# EasyEDA Pro project PCB.epro, board PCB1_4
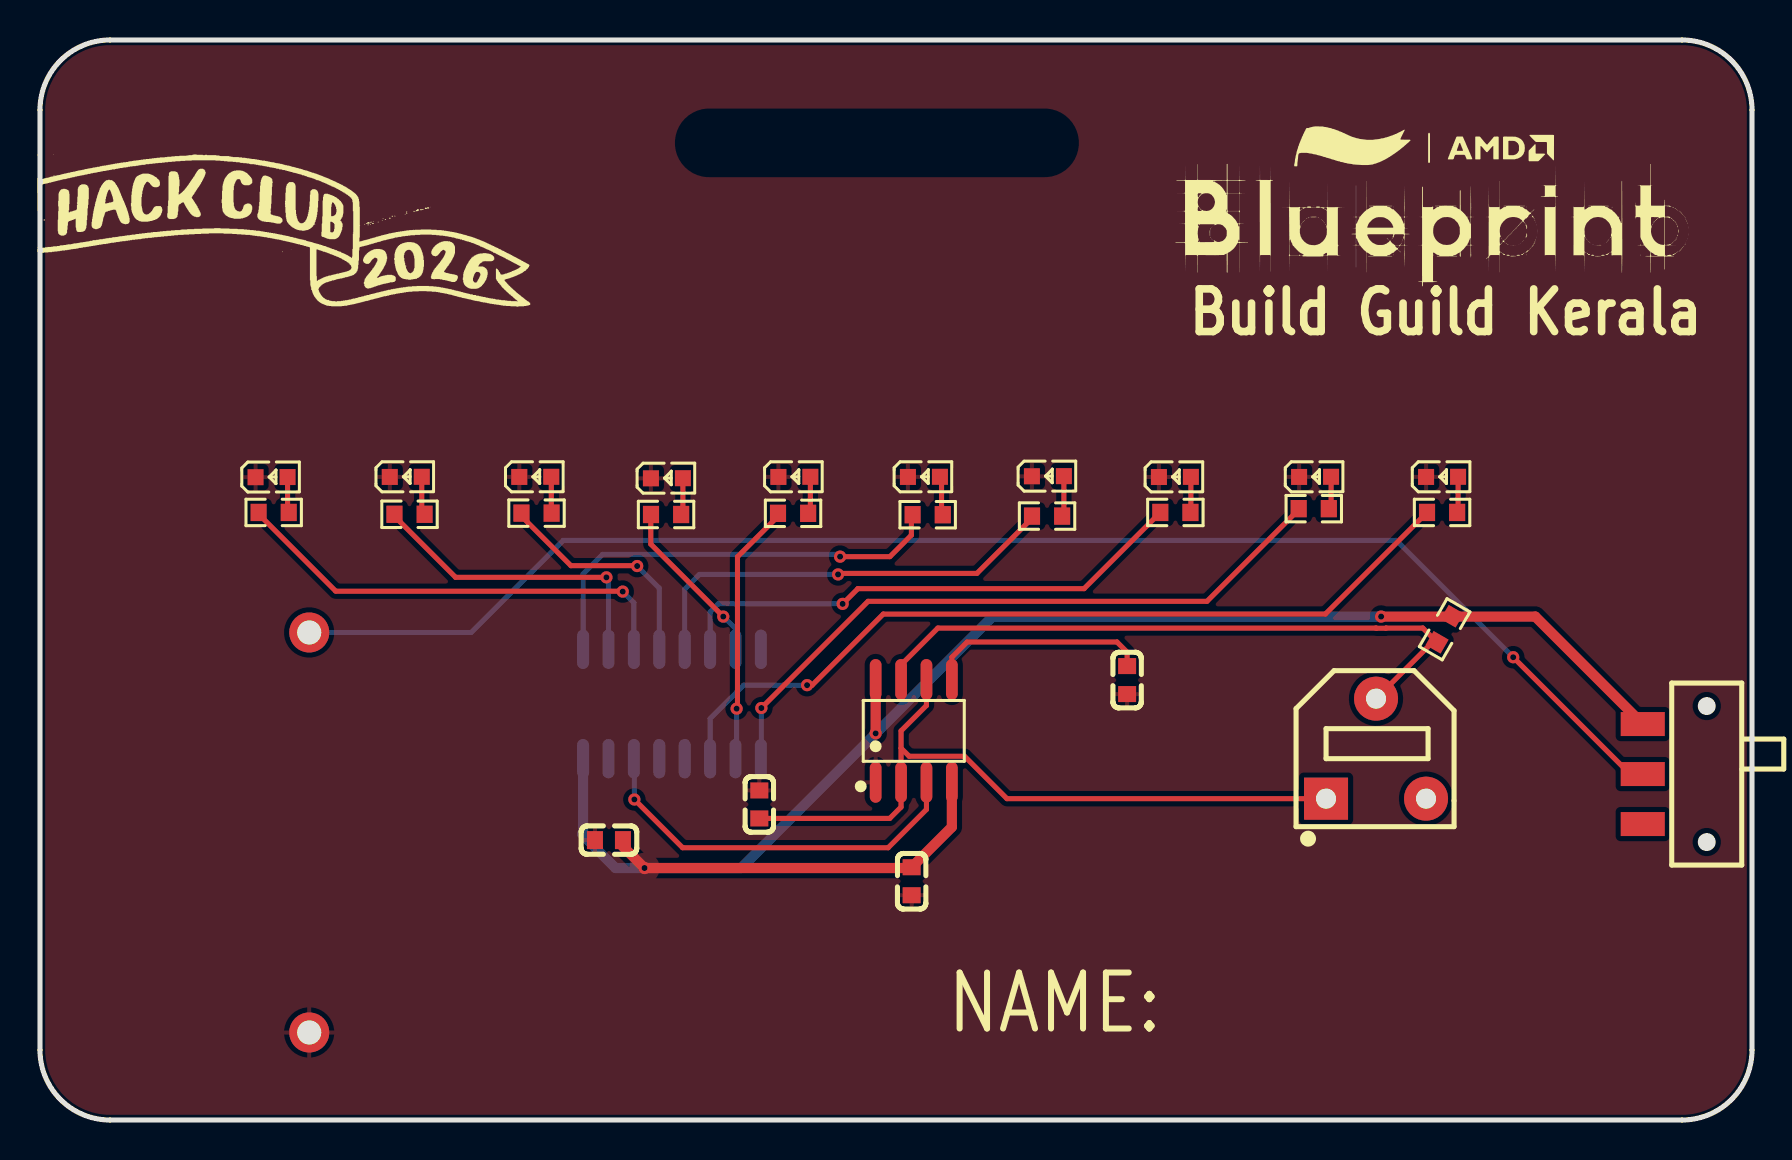
[diagram p13: board, top side]
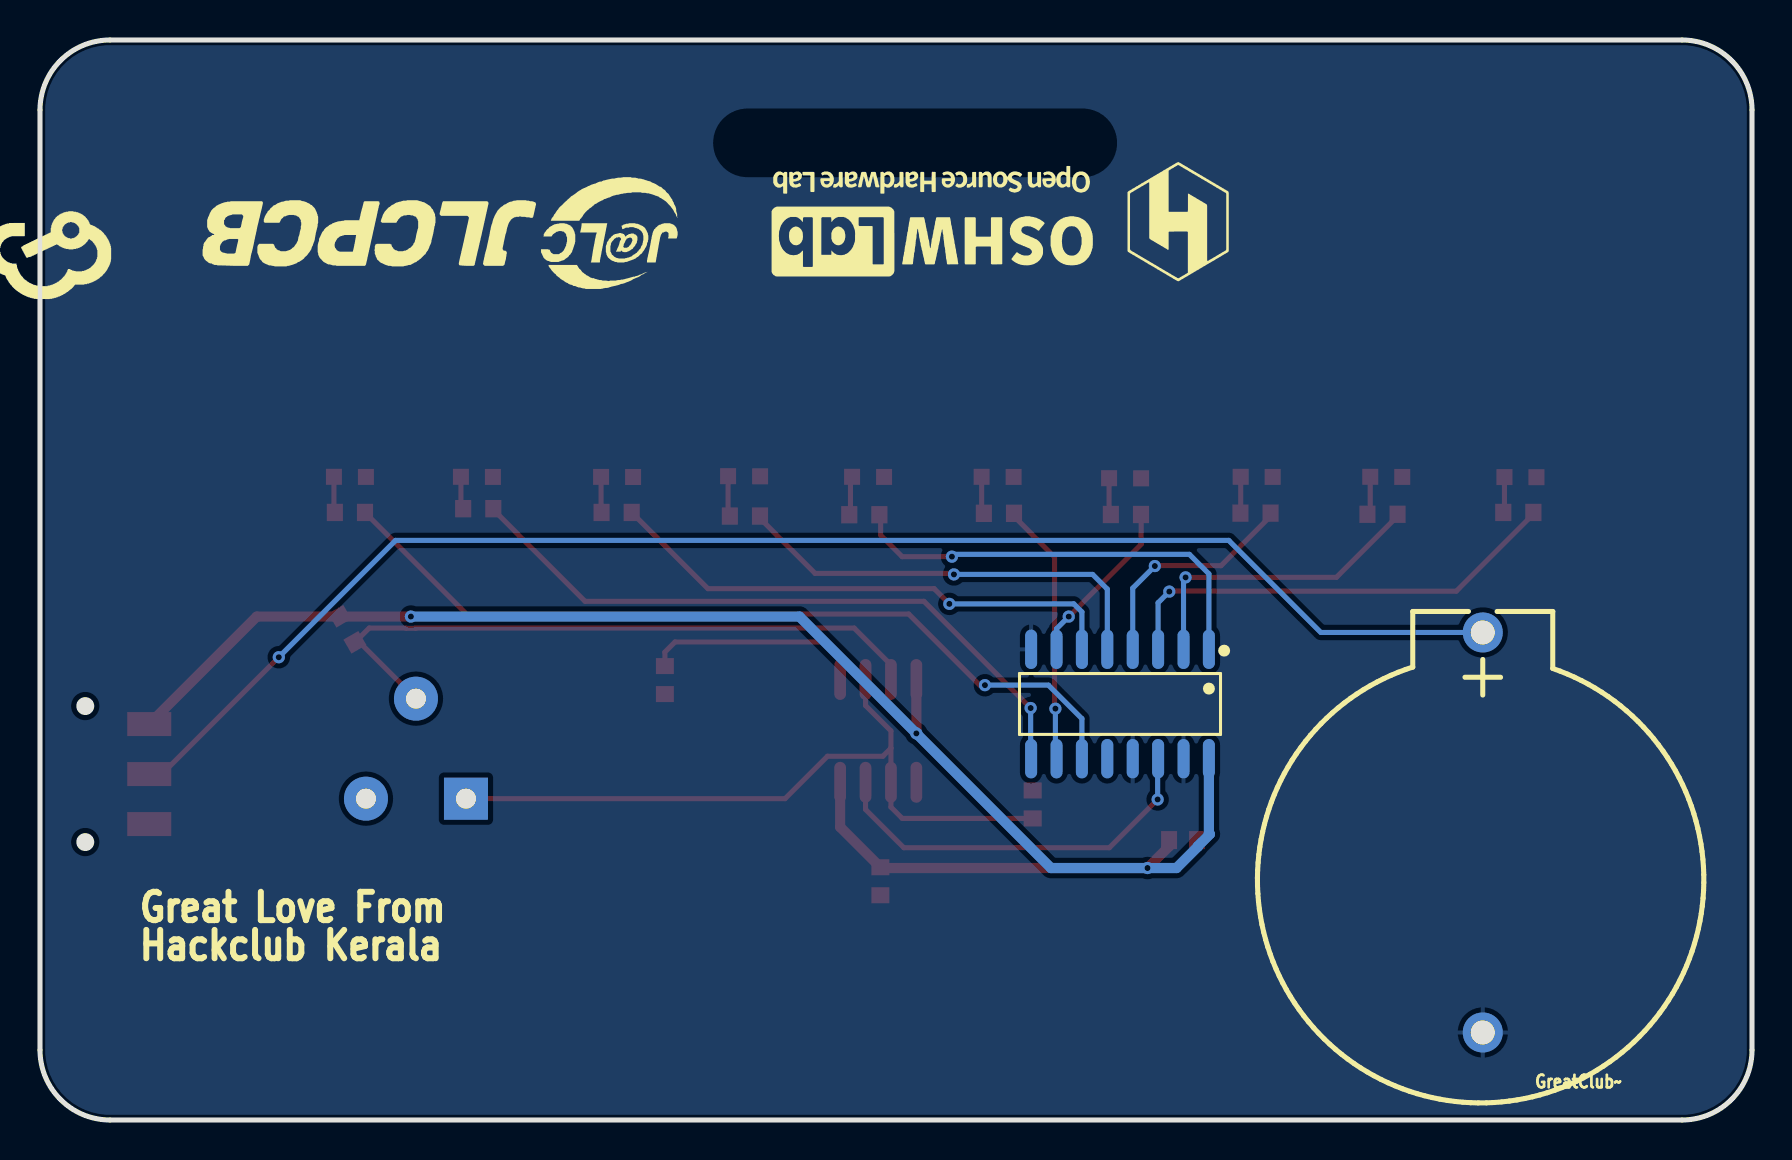
[diagram p14: board, bottom side, seen from below]

Outline 85.6 x 54 mm; copper layers: Top Layer, Bottom Layer. Coordinates in mm from the lower left corner of the outline.
Outline path: 0,50.5 0,3.5 arc(1.03,1.03) 3.5,0 82.1,0 arc(84.57,1.03) 85.6,3.5 85.6,50.5 arc(84.57,52.97) 82.1,54 3.5,54 arc(1.03,52.97) 0,50.5
Stack: Top Layer 0.035mm / Dielectric1 1.51mm FR4 er 4.5 / Bottom Layer 0.035mm

## Design rules (mm)
template: JLCPCB Capability(Two Layers Board)
spacing copperThickness1oz (default): track to track 0.102, other pairs 0.152 to 0.3
spacing copperThickness2oz: track to track 0.203, other pairs 0.152 to 0.3
track width copperThickness1oz (default): min 0.127, default 0.254, max 2.54
track width copperThickness2oz: min 0.203, default 0.254, max 2.54
differential pair differentialPair (default): width min 0.127, default 0.254, max 2.54; gap min 0.152, default 0.152
via viaSize (default): diameter min 0.5, default 0.61, max 10; hole min 0.3, default 0.305, max 6.3

## Placement (name value [footprint] x y rotation side)
BAT1  KH-CR2032-2-1  [BAT-TH_KH-CR2032-2-1]  13.46 14.38 90 bottom
C1  10uF  [C0603]  35.97 15.78 90 top
C2  100nF  [C0603]  54.36 22 270 top
C3  100nF  [C0603]  43.58 11.94 270 top
C4  100nF  [C0603]  28.45 14 180 top
LED1  YLED0603Y  [LED0603-RD-1]  11.58 32.14 0 top
LED2  YLED0603Y  [LED0603-RD-1]  18.29 32.16 0 top
LED3  YLED0603Y  [LED0603-RD-1]  24.76 32.16 0 top
LED4  YLED0603Y  [LED0603-RD-1]  31.34 32.09 0 top
LED5  YLED0603Y  [LED0603-RD-1]  37.72 32.16 0 top
LED6  YLED0603Y  [LED0603-RD-1]  44.2 32.16 0 top
LED7  YLED0603Y  [LED0603-RD-1]  50.4 32.19 0 top
LED8  YLED0603Y  [LED0603-RD-1]  56.75 32.15 0 top
LED9  YLED0603Y  [LED0603-RD-1]  63.75 32.16 0 top
LED10  YLED0603Y  [LED0603-RD-1]  70.1 32.16 0 top
R1  10kΩ  [R0603]  70.23 24.54 60 top
R2  470Ω  [R0603]  18.48 30.28 0 top
R3  470Ω  [R0603]  24.83 30.34 0 top
R4  470Ω  [R0603]  31.3 30.28 0 top
R5  470Ω  [R0603]  37.65 30.33 0 top
R6  470Ω  [R0603]  44.38 30.26 0 top
R7  470Ω  [R0603]  50.35 30.2 0 top
R8  470Ω  [R0603]  56.77 30.38 0 top
R9  470Ω  [R0603]  63.69 30.57 0 top
R10  470Ω  [R0603]  70.1 30.38 0 top
R11  470Ω  [R0603]  11.68 30.38 0 top
SW1  MST-12D18G2 SMD Slide Switch  [SW-SMD_3P-L9.1-W3.5-P2.50_MST-12D18G2]  80.14 17.3 270 top
U1  TLC555DRG  [SOIC-8_L4.9-W3.9-P1.27-LS6.0-BL]  43.69 19.46 0 top
U2  100kΩ  [RES-ADJ-SMD_RM065-V1]  66.8 18.57 0 top
U3  CD4017BM-TD  [SOIC-16_L9.9-W3.9-P1.27-LS6.0-BL]  31.6 20.8 0 bottom

## Footprints (pads in the part's own frame, mm; a bottom-side part is the same pattern mirrored in y, then rotated)
BAT-TH_KH-CR2032-2-1
  round 2 hole 1.2: 1(10,0) 2(-10,0)
C0603
  rect 0.8x0.9 smd: 1(-0.7,0) 2(0.7,0)
LED0603-RD-1
  rect 0.8x0.8 smd: 1(-0.799,-0.004) 2(0.799,0.004)
R0603
  rect 0.806x0.864 smd: 1(-0.753,0) 2(0.753,0)
RES-ADJ-SMD_RM065-V1
  rect 2.2x2.1 hole 1: 1(-2.5,-2.5)
  round 2.2 hole 1: 2(0,2.5) 3(2.5,-2.5)
SOIC-8_L4.9-W3.9-P1.27-LS6.0-BL
  oval 0.588x2.045 smd: 1(-1.905,-2.57) 2(-0.635,-2.57) 3(0.635,-2.57) 4(1.905,-2.57) 5(1.905,2.57) 6(0.635,2.57) 7(-0.635,2.57) 8(-1.905,2.57)
SOIC-16_L9.9-W3.9-P1.27-LS6.0-BL
  oval 0.602x1.971 smd: 1(-4.445,-2.736) 2(-3.175,-2.736) 3(-1.905,-2.736) 4(-0.635,-2.736) 5(0.635,-2.736) 6(1.905,-2.736) 7(3.175,-2.736) 8(4.445,-2.736) 9(4.445,2.736) 10(3.175,2.736) 11(1.905,2.736) 12(0.635,2.736) 13(-0.635,2.736) 14(-1.905,2.736) 15(-3.175,2.736) 16(-4.445,2.736)
SW-SMD_3P-L9.1-W3.5-P2.50_MST-12D18G2
  rect 1.2x2.2 smd: 1(-2.5,0) 2(0,0) 3(2.5,0)

## Nets
As in the schematic.

Pads without a net: SW1 3; U2 3; U3 12

## Via types
v1: diameter 0.61, hole 0.305, Top Layer to Bottom Layer, 15 vias

## Routing (per net, layer and track width the routed paths; a pad name or vN(x,y) marks a point on that pad's centre or on a via; arc(x,y) is an arc through that point)
VCC: length 88
  Top Layer w0.508: C3.1 45.59,14.65 U1.4 ; SW1.1 74.76,25.17 v1(67.06,25.17) ; 43.58,12.6 v1(30.23,12.6) 29.15,13.68 C4.1 ; U1.8 v1(41.78,19.33)
  Bottom Layer w0.508: U3.16 27.15,14.34 27.11,14.29 27.7,13.7 27.7,13.67 28.78,12.6 v1(30.23,12.6) 35.05,12.6 v1(41.78,19.33) 47.62,25.17 v1(67.06,25.17)
1: length 22.9
  Top Layer w0.254: v1(29.14,26.42) 29.12,26.44 14.79,26.44 10.95,30.28
  Bottom Layer w0.254: U3.3 29.69,25.86 v1(29.14,26.42)
2: length 15.6
  Top Layer w0.254: 17.66,30.25 20.78,27.13 v1(28.32,27.13)
  Bottom Layer w0.254: U3.2 28.42,27.03 v1(28.32,27.13)
3: length 11.5
  Top Layer w0.254: v1(29.86,27.7) 29.84,27.72 26.55,27.72 24.01,30.25
  Bottom Layer w0.254: v1(29.86,27.7) 30.96,26.59 U3.4
4: length 8.4
  Top Layer w0.254: 30.54,30.22 30.54,28.79 v1(34.16,25.17)
  Bottom Layer w0.254: U3.7 34.77,24.56 v1(34.16,25.17)
5: length 13.1
  Top Layer w0.254: v1(34.83,20.57) 34.87,20.61 34.87,28.16 36.97,30.25
  Bottom Layer w0.254: U3.10 34.83,18.12 v1(34.83,20.57)
6: length 22.1
  Top Layer w0.254: 43.57,30.25 43.57,29.24 42.49,28.17 v1(40,28.17)
  Bottom Layer w0.254: U3.1 27.15,27.31 28.13,28.28 39.89,28.28 v1(40,28.17)
7: length 21.9
  Top Layer w0.254: v1(39.9,27.28) 39.95,27.33 46.84,27.33 49.67,30.16
  Bottom Layer w0.254: v1(39.9,27.28) 32.97,27.28 32.23,26.54 U3.5
8: length 26.4
  Top Layer w0.254: R8.1 52.21,26.57 40.89,26.57 v1(40.13,25.81)
  Bottom Layer w0.254: U3.6 33.5,25.4 33.91,25.81 v1(40.13,25.81)
9: length 33.6
  Top Layer w0.254: 63.01,30.47 62.88,30.47 58.35,25.93 41.4,25.93 v1(36.07,20.6)
  Bottom Layer w0.254: v1(36.07,20.6) 36.07,18.09 U3.9
10: length 42.1
  Top Layer w0.254: v1(38.35,21.74) 38.61,21.74 42.16,25.3 64.27,25.3 R10.1
  Bottom Layer w0.254: U3.11 33.5,20.07 35.18,21.74 v1(38.35,21.74)
PIN: length 36.5
  Top Layer w0.254: 43.05,18.59 43.46,18.19 46.23,18.19 48.35,16.07 U2.1 ; 43.05,18.59 43.05,19.46 44.32,20.73 44.32,22.03 ; 43.05,18.59 U1.2 43.05,15.65 42.49,15.08 C1.1
$1N11512: length 32.7
  Top Layer w0.254: U1.7 43.05,22.76 44.89,24.6 66.8,24.6 66.81,24.59 67.3,24.59 67.31,24.6 69.14,24.6 R1.1 ; 69.72,23.88 69.62,23.88 U2.2
$1N11976: length 19.8
  Top Layer w0.254: v1(29.72,16.03) 32.13,13.61 42.41,13.61 44.32,15.53 44.32,16.89
  Bottom Layer w0.254: U3.14 29.72,18.04 v1(29.72,16.03)
$1N14501: length 11.4
  Top Layer w0.254: 54.36,22.44 54.36,23.39 53.85,23.9 46.35,23.9 45.59,23.14 U1.5
$1N14987: length 73.4
  Top Layer w0.254: v1(73.66,23.14) 79.5,17.3 SW1.2
  Bottom Layer w0.254: BAT1.1 21.56,24.38 26.16,28.98 67.82,28.98 v1(73.66,23.14)
$1N17110: length 1.9
  Top Layer w0.254: 12.46,30.28 12.38,30.36 LED1.2
$1N17152: length 1.9
  Top Layer w0.254: 19.17,30.25 19.09,30.33 LED2.2
$1N17194: length 1.9
  Top Layer w0.254: 25.52,30.25 25.56,30.3 LED3.2
$1N17236: length 1.9
  Top Layer w0.254: 32.05,30.22 32.14,30.32 LED4.2
$1N17278: length 1.9
  Top Layer w0.254: LED5.2 38.52,30.3 38.47,30.25
$1N17320: length 1.9
  Top Layer w0.254: 45.08,30.25 45.08,32.08 LED6.2
$1N17362: length 2
  Top Layer w0.254: 51.18,30.16 51.19,30.17 LED7.2
$1N17404: length 1.8
  Top Layer w0.254: LED8.2 57.54,30.4 R8.2
$1N17446: length 1.7
  Top Layer w0.254: 64.51,30.47 64.55,30.51 LED9.2
$1N17488: length 1.8
  Top Layer w0.254: R10.2 70.9,30.42 LED10.2

## Copper pours and planes (outline as drawn; the poured copper is in the pictures)
GND on Top Layer: -10.92,69.88 129.67,69.88 129.67,-18.26 -10.92,-18.26
GND on Bottom Layer: -23.24,64.92 109.35,64.92 109.35,-13.06 -23.24,-13.06

## Text on the board
Bottom Silkscreen Layer: GreatClub~ | Great Love From | Hackclub Kerala
Top Silkscreen Layer: Build Guild Kerala | NAME:
